# EAGLE design input (EAGLE 9.0.1)
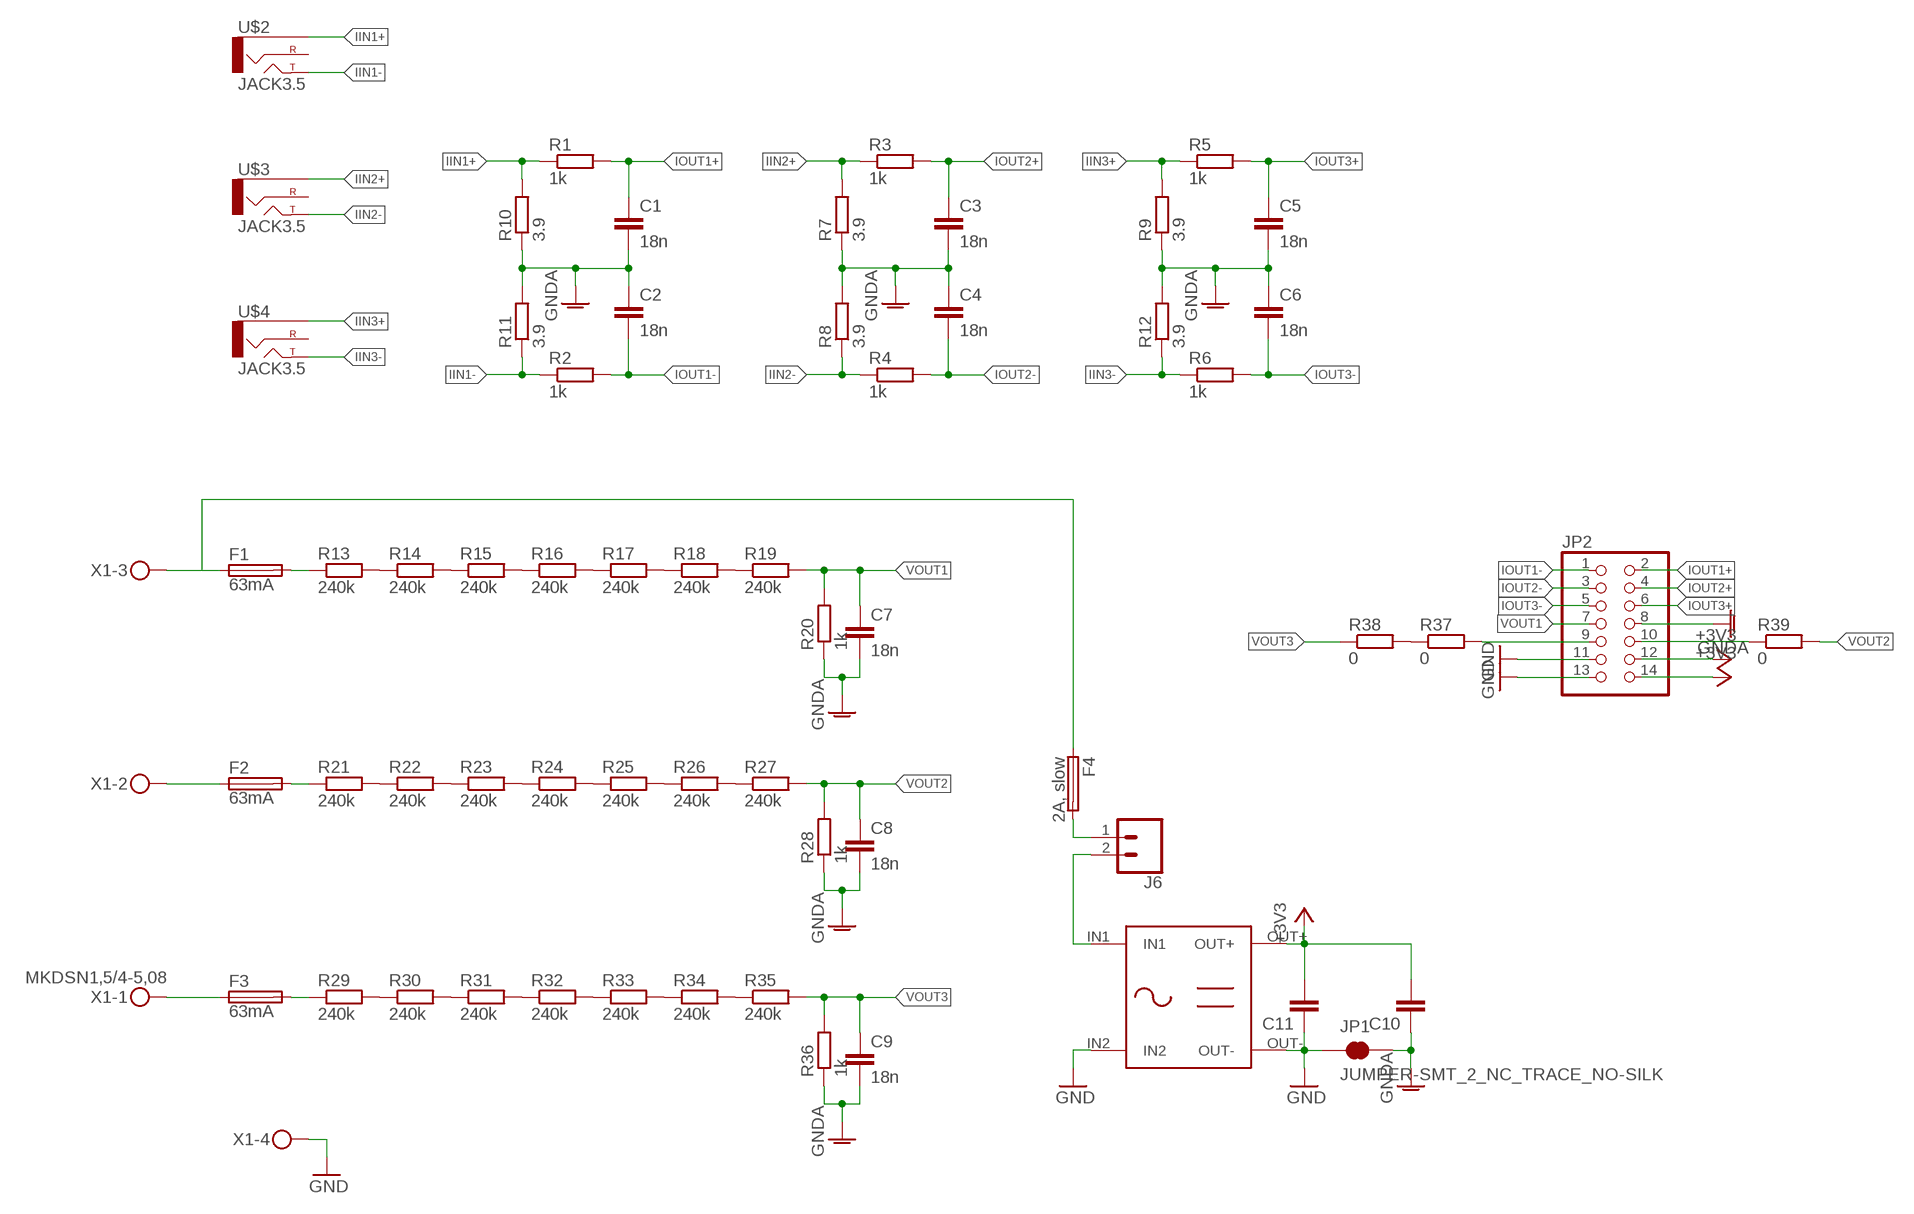
[diagram p0: schematic, sheet 1]

## Parts
C1  18n  C-EUC0805  [C0805]
C2  18n  C-EUC0805  [C0805]
C3  18n  C-EUC0805  [C0805]
C4  18n  C-EUC0805  [C0805]
C5  18n  C-EUC0805  [C0805]
C6  18n  C-EUC0805  [C0805]
C7  18n  C-EUC0805  [C0805]
C8  18n  C-EUC0805  [C0805]
C9  18n  C-EUC0805  [C0805]
C10  C-EUC1206  [C1206]
C11  C-EUC1206  [C1206]
F1  63mA  SH25  [SH25]
F2  63mA  SH25  [SH25]
F3  63mA  SH25  [SH25]
F4  2A, slow  SH25  [SH25]
J6  CONN_025MM  [SCREWTERMINAL-5MM-2]
JP1  JUMPER-SMT_2_NC_TRACE_NO-SILK  [SMT-JUMPER_2_NC_TRACE_NO-SILK]
JP2  PINHD-2X7  [2X07]
R1  1k  R-EU_M0805  [M0805]
R2  1k  R-EU_M0805  [M0805]
R3  1k  R-EU_M0805  [M0805]
R4  1k  R-EU_M0805  [M0805]
R5  1k  R-EU_M0805  [M0805]
R6  1k  R-EU_M0805  [M0805]
R7  3.9  R-EU_M0805  [M0805]
R8  3.9  R-EU_M0805  [M0805]
R9  3.9  R-EU_M0805  [M0805]
R10  3.9  R-EU_M0805  [M0805]
R11  3.9  R-EU_M0805  [M0805]
R12  3.9  R-EU_M0805  [M0805]
R13  240k  R-EU_R1206  [R1206]
R14  240k  R-EU_R1206  [R1206]
R15  240k  R-EU_R1206  [R1206]
R16  240k  R-EU_R1206  [R1206]
R17  240k  R-EU_R1206  [R1206]
R18  240k  R-EU_R1206  [R1206]
R19  240k  R-EU_R1206  [R1206]
R20  1k  R-EU_M0805  [M0805]
R21  240k  R-EU_R1206  [R1206]
R22  240k  R-EU_R1206  [R1206]
R23  240k  R-EU_R1206  [R1206]
R24  240k  R-EU_R1206  [R1206]
R25  240k  R-EU_R1206  [R1206]
R26  240k  R-EU_R1206  [R1206]
R27  240k  R-EU_R1206  [R1206]
R28  1k  R-EU_M0805  [M0805]
R29  240k  R-EU_R1206  [R1206]
R30  240k  R-EU_R1206  [R1206]
R31  240k  R-EU_R1206  [R1206]
R32  240k  R-EU_R1206  [R1206]
R33  240k  R-EU_R1206  [R1206]
R34  240k  R-EU_R1206  [R1206]
R35  240k  R-EU_R1206  [R1206]
R36  1k  R-EU_M0805  [M0805]
R37  0  R-EU_R1206  [R1206]
R38  0  R-EU_R1206  [R1206]
R39  0  R-EU_R1206  [R1206]
U$1  MW-IRM  [MW-IRM-DIP]
U$2  JACK3.5  [AUDIO-JACK]
U$3  JACK3.5  [AUDIO-JACK]
U$4  JACK3.5  [AUDIO-JACK]
X1  MKDSN1,5/4-5,08  [MKDSN1,5/4-5,08]

## Nets
+3V3: C10.2 C11.2 JP2.12 JP2.14 U$1.OUT+
GND: C11.1 JP1.1 JP2.11 JP2.13 U$1.IN2 U$1.OUT- X1.4
GNDA: C1.2 C2.1 C3.2 C4.1 C5.2 C6.1 C7.2 C8.2 C9.2 C10.1 JP1.2 JP2.8 R7.1 R8.2 R9.1 R10.1 R11.2 R12.2 R20.1 R28.1 R36.1
IIN1+: R1.1 R10.2 U$2.SLEEVE
IIN1-: R2.1 R11.1 U$2.TIP
IIN2+: R3.1 R7.2 U$3.SLEEVE
IIN2-: R4.1 R8.1 U$3.TIP
IIN3+: R5.1 R9.2 U$4.SLEEVE
IIN3-: R6.1 R12.1 U$4.TIP
IOUT1+: C1.1 JP2.2 R1.2
IOUT1-: C2.2 JP2.1 R2.2
IOUT2+: C3.1 JP2.4 R3.2
IOUT2-: C4.2 JP2.3 R4.2
IOUT3+: C5.1 JP2.6 R5.2
IOUT3-: C6.2 JP2.5 R6.2
N$1: R13.2 R14.1
N$2: R14.2 R15.1
N$3: R15.2 R16.1
N$4: R16.2 R17.1
N$5: R17.2 R18.1
N$6: R18.2 R19.1
N$7: F1.1 F4.1 X1.3
N$8: F4.2 J6.1
N$9: F3.2 R29.1
N$10: R21.2 R22.1
N$11: R22.2 R23.1
N$12: R23.2 R24.1
N$13: R25.2 R26.1
N$14: R26.2 R27.1
N$15: R24.2 R25.1
N$16: J6.2 U$1.IN1
N$17: R29.2 R30.1
N$18: R30.2 R31.1
N$19: R31.2 R32.1
N$20: R33.2 R34.1
N$21: R34.2 R35.1
N$22: R32.2 R33.1
N$23: R37.1 R38.2
N$24: F1.2 R13.1
N$25: F2.1 X1.2
N$26: JP2.10 R39.1
N$27: F2.2 R21.1
N$28: JP2.9 R37.2
N$29: F3.1 X1.1
VOUT1: C7.1 JP2.7 R19.2 R20.2
VOUT2: C8.1 R27.2 R28.2 R39.2
VOUT3: C9.1 R35.2 R36.2 R38.1
Unconnected: U$2.RING U$3.RING U$4.RING

## Library data of the parts
C1-C11 = rcl:C-EU: CAPACITOR, European symbol; SPICEPREFIX: C
F1-F4 = fuse:SH25: FUSE HOLDER grid 25 mm, OGN0031 8211, Schurter (Buerklin); MF: SCHURTER; MPN: 0031.8211; OC_FARNELL: 1162741; OC_NEWARK: 96B9380
J6 = SparkFun-Connectors:CONN_02: Multi connection point. Often used as Generic Header-pin footprint for 0.1 inch spaced/style header connections On any of the 0.1 inch spaced packages, you can populate with these: Break Away Headers - Straight <https://www.sparkfun.com/products/116> (PRT-00116) Break Away Male Headers - Right Angle <https://www.sparkfun.com/products/553> (PRT-00553) Female Headers <https://www.sparkfun.com/products/115> (PRT-00115) Break Away Headers - Machine Pin <https://www.sparkfun.com/products/117> (PRT-00117) Break Away Female Headers - Swiss Machine Pin <https://www.sparkfun.com/products/743> (PRT-00743) For SCREWTERMINALS and SPRING TERMINALS visit here: Screw Terimnals on SparkFun.com <https://www.sparkfun.com/search/results?term=Screw+Terminals> (5mm/3.5mm/2.54mm spacing) This device is also useful as a general connection point to wire up your design to another part of your project. Our various solder wires solder well into these plated through hole pads. Hook-Up Wire - Assortment (Stranded, 22 AWG) <https://www.sparkfun.com/products/11375> (PRT-11375) Hook-Up Wire - Assortment (Solid Core, 22 AWG) <https://www.sparkfun.com/products/11367> (PRT-11367) View the entire wire category on our website here <https://www.sparkfun.com/categories/141> Special notes: Molex polarized connector foot print use with: PRT-08233 with associated crimp pins and housings. 2.54_SCREWTERM for use with PRT-10571. 3.5mm Screw Terminal footprints for PRT-08084 5mm Screw Terminal footprints for use with PRT-08432; SF_SKU: PRT-08432
JP1 = SparkFun-Jumpers:JUMPER-SMT_2_NC_TRACE: Normally closed trace jumper This jumper has a trace between two pads so it's normally closed (NC). Use a razor knife to open the connection. For best results follow the IPC guidelines for cutting traces: Cutout at least 0.063 mm (0.005 in). Remove all loose material to clean up the cut area. Seal the cut with an approved epoxy. Reapply solder to reclose the connection.
JP2 = pinhead:PINHD-2X7: PIN HEADER
R1-R39 = rcl:R-EU_: RESISTOR, European symbol; SPICEPREFIX: R
U$1 = meanwell-IRM:MW-IRM
U$2-U$4 = 3-5mm-jack:JACK3.5
X1 = con-phoenix-508:MKDSN1,5/4-5,08: MKDSN 1,5/ 4-5,08 Printklemme Nennstrom: 13,5 A Nennspannung: 250 V Rastermaß: 5,08 mm Polzahl: 4 Anschlussart: Schraubanschluss Montage: Löten Anschlussrichtung Leiter/Platine: 0 ° Artikelnummer: 1729144 Source: http://eshop.phoenixcontact.com .. 1729144.pdf

## Board
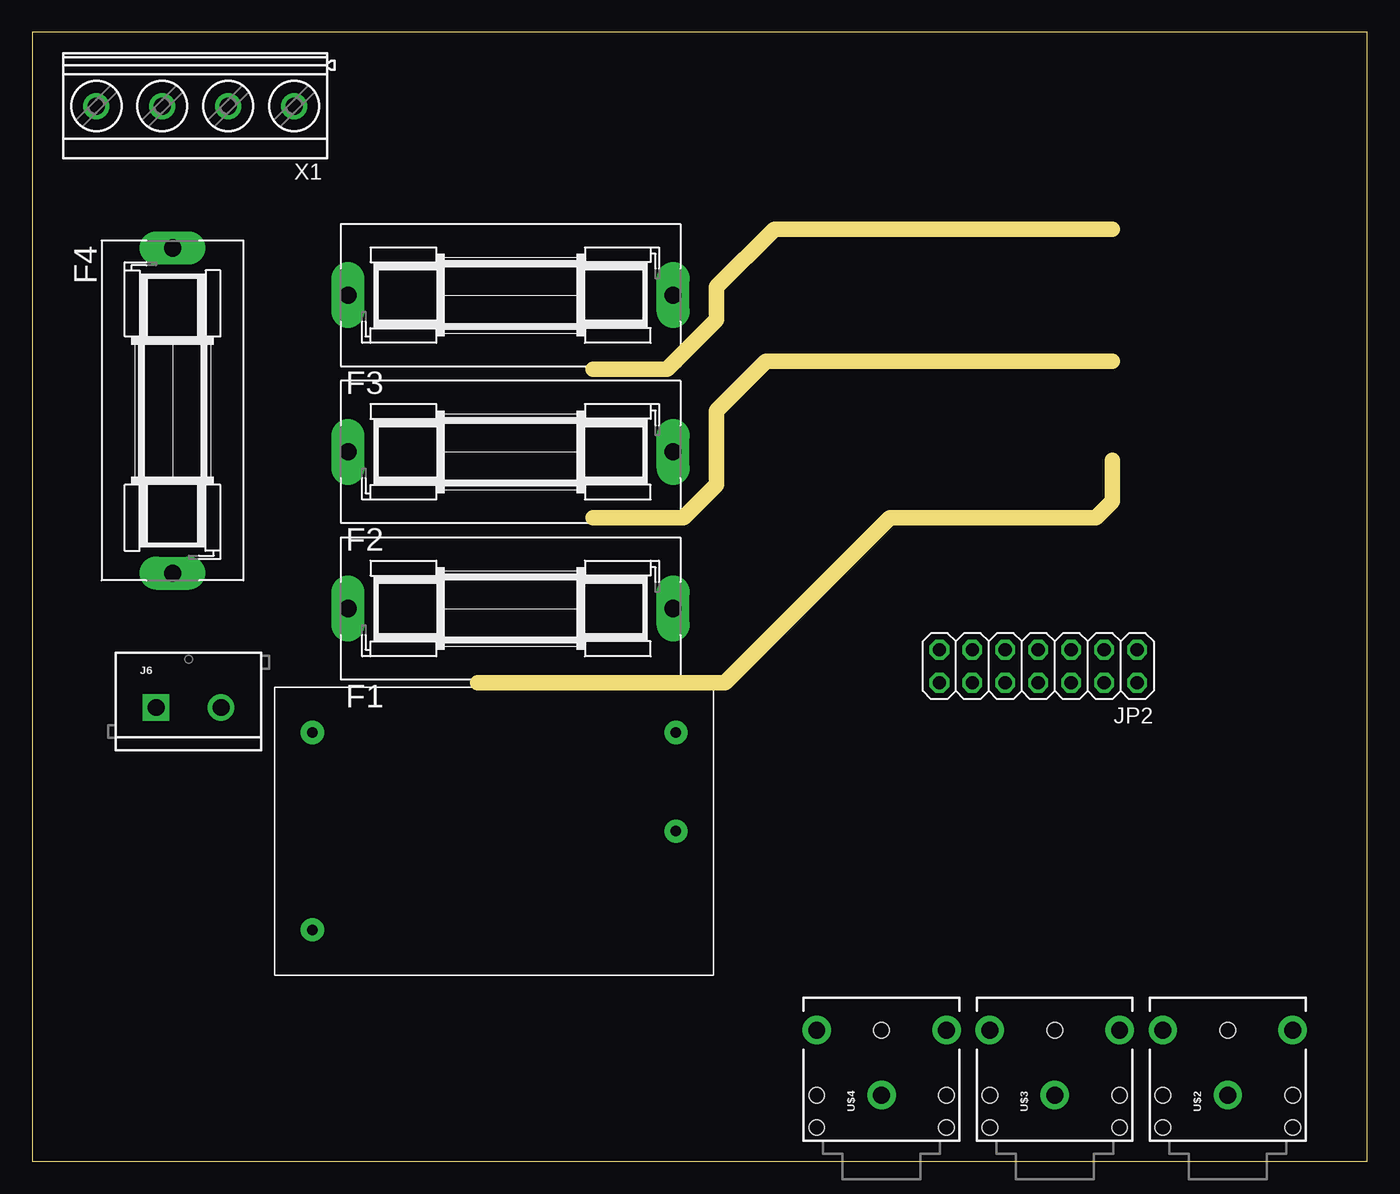
[diagram p1: board, top side]
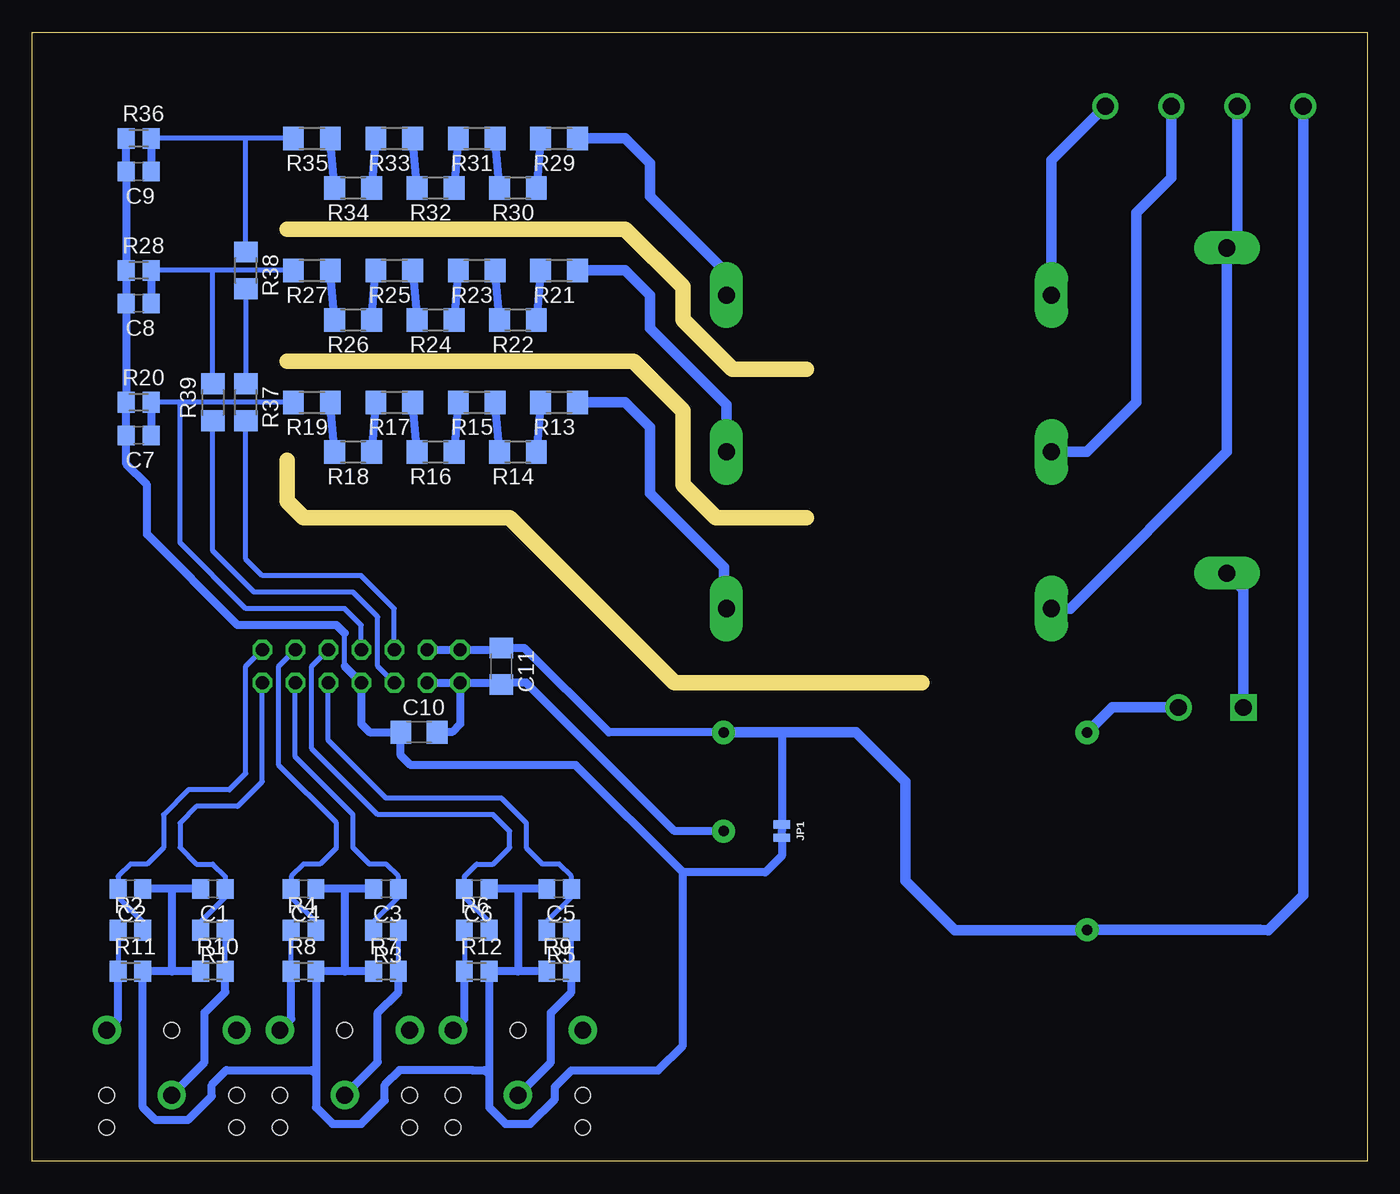
[diagram p2: board, bottom side, seen from below]

Size 102.8 x 86.9 mm. Coordinates in mm from the lower left corner, seen from the top.
Outline: 0,0 102.8,0 102.8,86.9 0,86.9 0,0
Copper layers (1*16): Top 0.035mm / dielectric 1.5mm / Bottom 0.035mm
Design rules "default": minimum track width 6mil, minimum drill 0.35mm, track to track 6mil, track to pad 6mil, pad to pad 6mil, via to via 6mil, smd to smd 6mil, copper to edge 40mil, drill to drill 6mil, minimum pad ring 10mil, minimum via ring 8mil, stop-mask expansion 4mil, vias tented up to drill 0mil, thermal gap 10mil
Milling: 15 lines

### Footprints (pad centres in the part's own frame; a part is rotated, then mirrored left to right if it is on the bottom)
C0805 = smd 1.3 x 1.5: 1 -0.95,0; 2 0.95,0
C1206 = smd 1.6 x 1.8: 1 -1.4,0; 2 1.4,0
SH25 = drill 1.321 pad 2.54 long: 1 -12.522,0; 2 12.522,0
SCREWTERMINAL-5MM-2 = drill 1.3 pad 2.032 square: 1 0,0 | drill 1.3 pad 2.032: 2 5,0
SMT-JUMPER_2_NC_TRACE_NO-SILK = smd 0.635 x 1.27: 1 -0.508,0; 2 0.508,0
2X07 = drill 1.016 octagon: 1 -7.62,-1.27; 2 -7.62,1.27; 3 -5.08,-1.27; 4 -5.08,1.27; 5 -2.54,-1.27; 6 -2.54,1.27; 7 0,-1.27; 8 0,1.27; 9 2.54,-1.27; 10 2.54,1.27; 11 5.08,-1.27; 12 5.08,1.27; 13 7.62,-1.27; 14 7.62,1.27
M0805 = smd 1.3 x 1.6: 1 -0.95,0; 2 0.95,0
R1206 = smd 1.6 x 1.803: 1 -1.422,0; 2 1.422,0
MW-IRM-DIP = drill 0.8 pad 1.778: IN1 -14,7.6; IN2 -14,-7.6; OUT+ 14,0; OUT- 14,7.6
AUDIO-JACK = drill 1.3 pad 2.184: RING 5,5; SLEEVE 0,0; TIP 5,-5 | hole 1.2: 0,5; -2.5,5; -2.5,-5; 0,-5; 5,0
MKDSN1,5/4-5,08 = drill 1.3 pad 2: 1 -7.641,0.025; 2 -2.561,0.025; 3 2.519,0.025; 4 7.599,0.025

### Placement (x,y rotation side)
C1  88.9,20.95 180 bottom
C2  95.25,20.95 180 bottom
C3  75.56,20.95 180 bottom
C4  81.92,20.95 180 bottom
C5  62.23,20.95 180 bottom
C6  68.58,20.95 180 bottom
C7  94.61,55.88 180 bottom
C8  94.61,66.04 180 bottom
C9  94.61,76.2 180 bottom
C10  73.03,33.02 0 bottom
C11  66.67,38.1 270 bottom
F1  36.83,42.55 0 top
F2  36.83,54.61 0 top
F3  36.83,66.67 0 top
F4  10.79,57.78 270 top
J6  9.53,34.92 0 top
JP1  45.09,25.4 270 bottom
JP2  77.47,38.1 180 top
R1  88.9,17.78 180 bottom
R2  95.25,17.78 0 bottom
R3  75.56,17.78 180 bottom
R4  81.92,17.78 0 bottom
R5  62.23,17.78 180 bottom
R6  68.58,17.78 0 bottom
R7  75.56,14.61 0 bottom
R8  81.92,14.61 0 bottom
R9  62.23,14.61 0 bottom
R10  88.9,14.61 0 bottom
R11  95.25,14.61 0 bottom
R12  68.58,14.61 0 bottom
R13  62.23,58.42 180 bottom
R14  65.41,54.61 180 bottom
R15  68.58,58.42 180 bottom
R16  71.75,54.61 180 bottom
R17  74.93,58.42 180 bottom
R18  78.11,54.61 180 bottom
R19  81.28,58.42 180 bottom
R20  94.61,58.42 0 bottom
R21  62.23,68.58 180 bottom
R22  65.41,64.77 180 bottom
R23  68.58,68.58 180 bottom
R24  71.75,64.77 180 bottom
R25  74.93,68.58 180 bottom
R26  78.11,64.77 180 bottom
R27  81.28,68.58 180 bottom
R28  94.61,68.58 0 bottom
R29  62.23,78.74 180 bottom
R30  65.41,74.93 180 bottom
R31  68.58,78.74 180 bottom
R32  71.75,74.93 180 bottom
R33  74.93,78.74 180 bottom
R34  78.11,74.93 180 bottom
R35  81.28,78.74 180 bottom
R36  94.61,78.74 0 bottom
R37  86.36,58.42 270 bottom
R38  86.36,68.58 270 bottom
R39  88.9,58.42 90 bottom
U$1  35.56,25.4 0 top
U$2  92.08,5.08 90 top
U$3  78.74,5.08 90 top
U$4  65.41,5.08 90 top
X1  12.52,81.25 180 top

### Tracks (layer width: path | path; a pad name or v marks a point on that pad's centre or on a via)
+3V3
  Bottom 0.6: JP2.12 JP2.14 | JP2.14 66.81,36.83 | 66.81,36.83 C11.2 | U$1.OUT+ 53.34,25.4 64.77,36.83 66.81,36.83 | JP2.14 69.85,33.66 70.48,33.02 C10.2
GND
  Bottom 0.6: JP2.11 JP2.13 66.81,39.37 C11.1 64.9,39.5 58.4,33 U$1.OUT- | 45.09,33 JP1.1 45.09,25.4 45.09,24.77
  Bottom 0.8: X1.4 4.92,20.48 7.62,17.78 8.28,17.8 U$1.IN2 21.58,17.78 31.75,17.78 35.56,21.59 35.56,29.21 39.35,33 45.09,33 U$1.OUT-
GNDA
  Bottom 0.4: 78.74,38.1 78.74,40.64
  Bottom 0.6: R9.1 65.41,14.61 | 65.41,14.61 R12.2 67.63,6.67 | R10.1 92.08,14.61 | 92.08,14.61 R11.2 | R11.2 | R7.1 78.74,14.61 | 78.74,14.61 R8.2 80.97,6.67 | C5.2 65.41,20.95 | C1.2 92.08,20.95 | 92.08,20.95 C2.1 | C3.2 78.74,20.95 | 78.74,20.95 C4.1 | 65.41,20.95 65.41,14.61 | 92.08,20.95 92.08,14.61 | 78.74,20.95 78.74,14.61 | 65.41,20.95 C6.1 | 80.97,6.67 80.97,4.13 79.69,2.86 77.47,2.86 75.66,4.67 75.66,5.87 74.53,7 68.91,7 | R11.2 94.3,4.13 93.34,3.17 90.81,3.17 88.99,4.99 88.99,5.87 87.87,7 81.29,7 80.97,6.67 | R36.1 C9.2 R28.1 C8.2 R20.1 C7.2 95.56,53.66 93.98,52.07 93.98,48.26 87,41.27 79.38,41.27 78.74,40.64 | 68.9,6.99 68.91,7 | 78.74,38.1 JP2.8 77.47,33.66 76.83,33.02 C10.1 74.42,31.25 73.66,30.48 60.96,30.48 52.7,22.23 | JP1.2 45.09,23.5 46.35,22.23 52.7,22.23 | 67.63,6.67 67.63,4.13 66.36,2.86 64.45,2.86 62.55,4.76 62.55,5.71 61.28,6.99 54.61,6.99 52.7,8.89 52.7,22.23 | 68.91,7 67.96,7 67.63,6.67
IIN1+
  Bottom 0.4: R10.2 R1.1
  Bottom 0.6: U$2.SLEEVE 89.53,7.62 89.53,11.43 87.95,13.02 R10.2
IIN1-
  Bottom 0.4: R2.1 R11.1
  Bottom 0.6: U$2.TIP 96.2,10.96 R11.1
IIN2+
  Bottom 0.4: R7.2 R3.1
  Bottom 0.6: U$3.SLEEVE 76.2,7.62 76.2,11.43 74.61,13.02 R7.2
IIN2-
  Bottom 0.4: R8.1 R4.1
  Bottom 0.6: U$3.TIP 82.86,10.96 R8.1
IIN3+
  Bottom 0.4: R9.2 R5.1
  Bottom 0.6: U$4.SLEEVE 62.87,7.62 62.87,11.43 61.28,13.02 R9.2
IIN3-
  Bottom 0.4: R6.1 R12.1
  Bottom 0.6: U$4.TIP 69.53,10.96 R12.1
IOUT1+
  Bottom 0.4: R1.2 89.85,18.41 87.95,20.32 C1.1 87.95,21.91 88.9,22.86 90.17,22.86 91.44,24.13 91.44,26.04 90.17,27.3 87,27.3 85.09,29.21 JP2.2
IOUT1-
  Bottom 0.4: R2.2 94.3,18.41 96.2,20.32 C2.2 96.2,21.91 95.25,22.86 93.98,22.86 92.71,24.13 92.71,26.67 90.81,28.57 87.63,28.57 86.36,29.84 86.36,38.1 JP2.1
IOUT2+
  Bottom 0.4: R3.2 76.52,18.41 74.61,20.32 C3.1 74.61,21.91 75.56,22.86 76.83,22.86 78.11,24.13 78.11,26.67 82.55,31.11 JP2.4
IOUT2-
  Bottom 0.4: R4.2 80.96,18.41 82.86,20.32 C4.2 82.86,21.91 81.92,22.86 80.64,22.86 79.38,24.13 79.38,26.04 83.82,30.48 83.82,38.1 JP2.3
IOUT3+
  Bottom 0.4: R5.2 63.18,18.41 61.28,20.32 C5.1 61.28,21.91 62.23,22.86 63.5,22.86 64.77,24.13 64.77,26.04 66.67,27.94 75.56,27.94 80.01,32.38 JP2.6
IOUT3-
  Bottom 0.4: R6.2 67.63,18.41 69.53,20.32 C6.2 69.53,21.91 68.58,22.86 67.31,22.86 66.04,24.13 66.04,25.4 67.31,26.67 76.2,26.67 81.28,31.75 81.28,38.1 JP2.5
N$1
  Bottom 0.6: R13.2 R14.1
N$2
  Bottom 0.6: R14.2 R15.1
N$3
  Bottom 0.6: R15.2 R16.1
N$4
  Bottom 0.6: R16.2 R17.1
N$5
  Bottom 0.6: R17.2 R18.1
N$6
  Bottom 0.6: R18.2 R19.1
N$7
  Bottom 0.8: X1.3 10,71.11 F4.1 10.79,54.61 22.86,42.55 F1.1
N$8
  Bottom 0.8: J6.1 9.53,43.99 F4.2
N$9
  Bottom 0.8: R29.1 57.15,78.74 55.24,76.83 55.24,74.3 49.35,68.4 F3.2
N$10
  Bottom 0.6: R21.2 R22.1
N$11
  Bottom 0.6: R22.2 R23.1
N$12
  Bottom 0.6: R23.2 R24.1
N$13
  Bottom 0.6: R26.1 R25.2
N$14
  Bottom 0.6: R26.2 R27.1
N$15
  Bottom 0.6: R25.1 R24.2
N$16
  Bottom 0.8: J6.2 19.64,34.92 U$1.IN1
N$17
  Bottom 0.6: R29.2 R30.1
N$18
  Bottom 0.6: R30.2 R31.1
N$19
  Bottom 0.6: R31.2 R32.1
N$20
  Bottom 0.6: R33.2 R34.1
N$21
  Bottom 0.6: R34.2 R35.1
N$22
  Bottom 0.6: R32.2 R33.1
N$23
  Bottom 0.4: R38.2 R37.1
N$24
  Bottom 0.8: F1.2 49.53,42.72 49.53,45.72 55.24,51.44 55.24,56.52 57.15,58.42 R13.1
N$25
  Bottom 0.8: X1.2 15.08,75.73 17.78,73.03 17.78,58.42 21.59,54.61 F2.1
N$26
  Bottom 0.4: JP2.10 76.2,38.1 76.2,41.91 78.11,43.81 85.72,43.81 88.9,46.99 R39.1
N$27
  Bottom 0.8: R21.1 57.15,68.58 55.24,66.67 55.24,64.14 49.35,58.24 F2.2
N$28
  Bottom 0.4: JP2.9 74.93,42.55 77.47,45.09 85.09,45.09 86.36,46.35 R37.2
N$29
  Bottom 0.8: X1.1 24.31,77.07 F3.1
VOUT1
  Bottom 0.4: R19.2 91.44,58.42 | 91.44,58.42 R20.2 | 91.44,58.42 91.44,47.62 86.36,42.55 78.74,42.55 77.47,41.27 JP2.7
  Bottom 0.6: R20.2 C7.1
VOUT2
  Bottom 0.4: R27.2 88.9,68.58 | 88.9,68.58 R28.2 | R39.2 88.9,68.58
  Bottom 0.6: R28.2 C8.1
VOUT3
  Bottom 0.4: R35.2 86.36,78.74 | 86.36,78.74 R36.2 | R38.1 86.36,78.74
  Bottom 0.6: R36.2 C9.1